# Altium project MSXIV_Rear_Power_Distribution.PrjPcb (part 1 of 4)
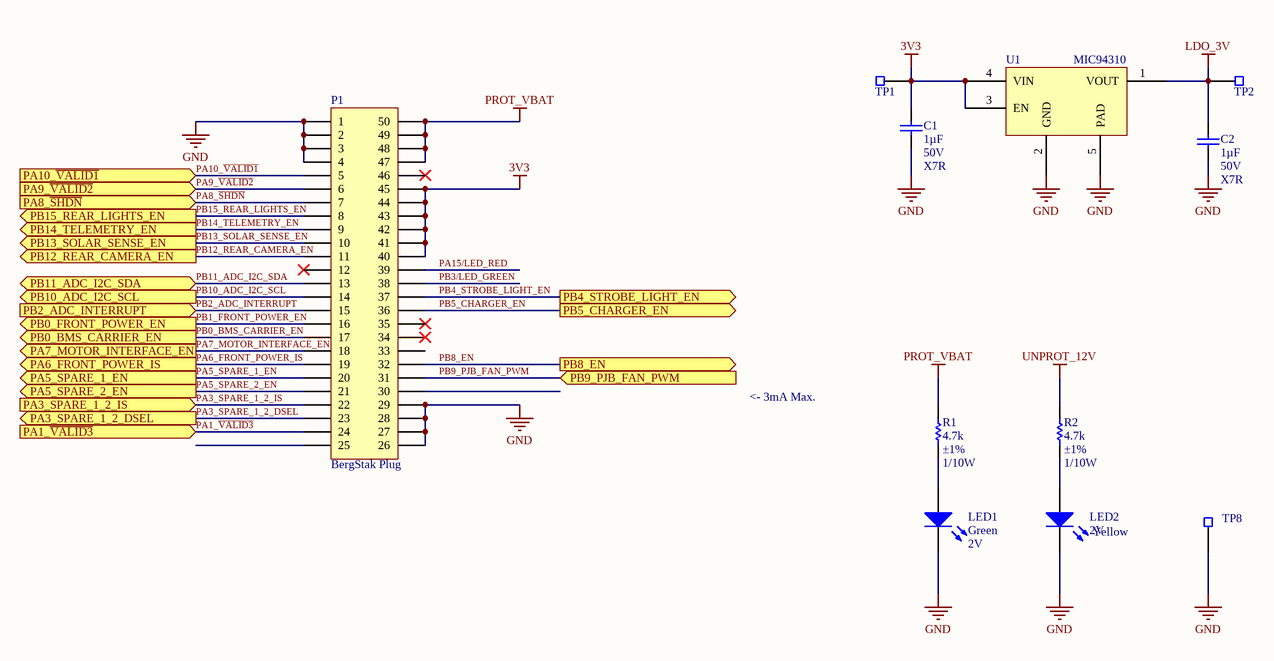
[diagram p0: Controller_Board_Interface.SchDoc]
19 sheets, 269 parts. Net scope: hierarchical (ports join the sheet entries above them; power ports are global).
Sheets:
  Controller_Board_Interface.SchDoc
  Power Distribution - Power Supply.SchDoc
  Power Distribution - DC-DC.SchDoc
    Temperature Sense = Power Distribution - Temperature Sense.SchDoc
  Power Distribution - Aux Battery.SchDoc
  Power Distribution - Power Path.SchDoc
    Designator = Power Distribution - Power Path 3 Parallel MOSFET.SchDoc
    Designator = Power Distribution - Power Path 2 Parallel MOSFET.SchDoc
    Designator = Power Distribution - Power Path 3 Parallel MOSFET.SchDoc
  Power Distribution - Hight Current Load Switch.SchDoc
  Power Distribution - Solar Sense and Strobe Light.SchDoc
    LLS? = Power Distribution - Low Current Load Driver.SchDoc
  Power Distribution - Motor Interface and Rear light (rear board).SchDoc
    LLS? = Power Distribution - Low Current Load Driver.SchDoc
  Power Distribution - Telemetry, BMS, Rear camera, and Charger (rear board).SchDoc
    LLS? = Power Distribution - Low Current Load Driver.SchDoc
    LLS? = Power Distribution - Low Current Load Driver.SchDoc
  Power Distribution - PJB.SchDoc
  Power Distribution - Output to front Power Board.SchDoc
  Power Distribution - External ADC.SchDoc
    ADC? = Power Distribution - ADC.SchDoc
    ADC? = Power Distribution - ADC.SchDoc
    ADC? = Power Distribution - ADC.SchDoc
  Power Distribution - IO Expander.SchDoc
  Power Distribution - Spare Load Switch.SchDoc
    LLS? = Power Distribution - Low Current Load Driver.SchDoc

## Sheet Controller_Board_Interface.SchDoc: Controller Board Interface
size B; Organization: Midnight Sun Solar Rayce Car Team; Address1: University of Waterloo; Address2: 200 University Ave W; Address3: Waterloo, ON, Canada; Address4: N2L 3E9; Website: www.uwmidsun.com; ProjectName: ProjectName

### Parts
C1  Capacitance: 1µF  Voltage: 50V  Temperature Coefficient: X7R  [CAP, 0603]  (hidden comment: CAP CER 1UF 50V 10% X7R 0603)
C2  Capacitance: 1µF  Voltage: 50V  Temperature Coefficient: X7R  [CAP, 0603]  (hidden comment: CAP CER 1UF 50V 10% X7R 0603)
LED1  Color: Green  Voltage - Forward (Vf) (Typ): 2V  [LED_0603]  (hidden comment: LED GREEN CLEAR 2V 0603)
LED2  Voltage - Forward (Vf) (Typ): 2V  [LED_0603]  (hidden comment: LED YELLOW CLEAR 2.1V 0603)
P1  Series: BergStak Plug  [CONN, Bergstak 50 Pos Plug]  (hidden comment: CONN 50POS Bergstak Plug 0.02")
R1  Resistance (Ohms): 4.7k  Tolerance: ±1%  Power (Watts): 1/10W  [RES, 0603]  (hidden comment: RES 4.7K OHM 1% 1/10W 0603)
R2  Resistance (Ohms): 4.7k  Tolerance: ±1%  Power (Watts): 1/10W  [RES, 0603]  (hidden comment: RES 4.7K OHM 1% 1/10W 0603)
TP1  Test Point 0603 SMD  [TEST POINT 0603 SMD]  (value not drawn)
TP2  Test Point 0603 SMD  [TEST POINT 0603 SMD]  (value not drawn)
TP8  Test Point 0603 SMD  [TEST POINT 0603 SMD]  (value not drawn)
U1  Manufacturer Part Number: MIC94310  [IC REG LDO 3V 0.2A 4-TDFN]  (hidden comment: IC REG LDO 3V 0.2A 4-TDFN)

### Ports
PA1_~{VALID3} (in), PA3_SPARE_1_2_DSEL (out), PA3_SPARE_1_2_IS (in), PA5_SPARE_1_EN (out), PA5_SPARE_2_EN (out), PA6_FRONT_POWER_IS (out), PA7_MOTOR_INTERFACE_EN (out), PA8_~{SHDN} (in), PA9_~{VALID2} (in), PA10_~{VALID1} (in), PB0_BMS_CARRIER_EN (out), PB0_FRONT_POWER_EN (out), PB2_ADC_INTERRUPT (in), PB4_STROBE_LIGHT_EN (out), PB5_CHARGER_EN (out), PB8_EN (out), PB9_PJB_FAN_PWM (in), PB10_ADC_I2C_SCL (out), PB11_ADC_I2C_SDA (bidir), PB12_REAR_CAMERA_EN (out), PB13_SOLAR_SENSE_EN (out), PB14_TELEMETRY_EN (out), PB15_REAR_LIGHTS_EN (out)

### Nets
3V3: C1.1 P1.40 P1.41 P1.42 P1.43 P1.44 P1.45 TP1.1 U1.3(EN) U1.4(VIN)
GND: C1.2 C2.2 LED1.2(K) LED2.2(K) P1.1 P1.2 P1.3 P1.4 P1.26 P1.27 P1.28 P1.29 TP8.1 U1.2(GND) U1.5(PAD)  [project net AUX_BAT_IN]
LDO_3V: C2.1 TP2.1 U1.1(VOUT)
PROT_VBAT: P1.47 P1.48 P1.49 P1.50 R1.1
UNPROT_12V: R2.1
PA1_~{VALID3}: P1.24 ; port PA1_~{VALID3}
PA3_SPARE_1_2_DSEL: P1.23 ; port PA3_SPARE_1_2_DSEL
PA3_SPARE_1_2_IS: P1.22 ; port PA3_SPARE_1_2_IS
PA5_SPARE_1_EN: P1.20 ; port PA5_SPARE_1_EN
PA5_SPARE_2_EN: P1.21 ; port PA5_SPARE_2_EN
PA6_FRONT_POWER_IS: P1.19 ; port PA6_FRONT_POWER_IS
PA7_MOTOR_INTERFACE_EN: P1.18 ; port PA7_MOTOR_INTERFACE_EN
PA8_~{SHDN}: P1.7 ; port PA8_~{SHDN}
PA9_~{VALID2}: P1.6 ; port PA9_~{VALID2}
PA10_~{VALID1}: P1.5 ; port PA10_~{VALID1}
PA15/LED_RED: P1.39
PB0_BMS_CARRIER_EN: P1.17 ; port PB0_BMS_CARRIER_EN
PB1_FRONT_POWER_EN: P1.16 ; port PB0_FRONT_POWER_EN
PB2_ADC_INTERRUPT: P1.15 ; port PB2_ADC_INTERRUPT
PB3/LED_GREEN: P1.38
PB4_STROBE_LIGHT_EN: P1.37 ; port PB4_STROBE_LIGHT_EN
PB5_CHARGER_EN: P1.36 ; port PB5_CHARGER_EN
PB8_EN: P1.32 ; port PB8_EN
PB9_PJB_FAN_PWM: P1.31 ; port PB9_PJB_FAN_PWM
PB10_ADC_I2C_SCL: P1.14 ; port PB10_ADC_I2C_SCL
PB11_ADC_I2C_SDA: P1.13 ; port PB11_ADC_I2C_SDA
PB12_REAR_CAMERA_EN: P1.11 ; port PB12_REAR_CAMERA_EN
PB13_SOLAR_SENSE_EN: P1.10 ; port PB13_SOLAR_SENSE_EN
PB14_TELEMETRY_EN: P1.9 ; port PB14_TELEMETRY_EN
PB15_REAR_LIGHTS_EN: P1.8 ; port PB15_REAR_LIGHTS_EN
NetLED1_1: LED1.1(A) R1.2
NetLED2_1: LED2.1(A) R2.2

Not connected (* = marked no-connect by the designer): P1 12* 25 30 33 34* 35* 46*

### Notes on the sheet
- <- 3mA Max.
- (near LED2) Yellow
- PROJECT
- DOCUMENT
- DRAWN BY
- LAST MODIFIED
- PART NUMBER
- REVISION
- SHEET
- VARIANT
- OF
- Engineering 5 - 1002
  University of Waterloo
  (519) 888-4567 x32978
  hardware@uwmidsun.com

### Library data of the parts
C1 C2 = CAP CER 1UF 50V 10% X7R 0603: 1µF ±10% 50V Ceramic Capacitor X7R 0603 (1608 Metric); Manufacturer 1: Taiyo Yuden; Manufacturer Part Number 1: UMK107AB7105KA-T; Supplier 1: Digi-Key; Supplier Part Number 1: 587-3247-1-ND; Packaging: Cut Tape (CT); Part Status: Active; Operating Temperature: -55°C ~ 125°C; Ratings: -; Mounting Type: Surface Mount, MLCC; Package / Case: 0603 (1608 Metric); Size / Dimension: 0.063" L x 0.031" W (1.60mm x 0.80mm); Height - Seated (Max): -; Thickness (Max): 0.037" (0.95mm); Lead Spacing: -; Lead Style: -; ComponentLink1URL: http://www.yuden.co.jp/productdata/catalog/en/mlcc_all_e.pdf; ComponentLink1Description: http://www.yuden.co.jp/productdata/catalog/en/mlcc_all_e.pdf; Tolerance: ±10%
LED1 = LED GREEN CLEAR 2V 0603: Green 572nm LED Indication - Discrete 2V 0603 (1608 Metric); Manufacturer: Wurth Electronics Inc.; Manufacturer Part Number: 150060VS75000; Lens Color: Colorless; Millicandela Rating: 40mcd; Lens Style/Size: Rectangle with Flat Top, 1.10mm x 0.70mm; Current - Test: 20mA; Viewing Angle: 140°; Wavelength - Dominant: 570nm; Supplier 1: Digi-Key; Supplier Part Number 1: 732-4980-1-ND; Packaging: Cut Tape (CT); Part Status: Active; Lens Transparency: Clear; Mounting Type: Surface Mount; Wavelength - Peak: 572nm; Package / Case: 0603 (1608 Metric); Supplier Device Package: 0603; Size / Dimension: 1.60mm L x 0.80mm W; Height (Max): 0.80mm; ComponentLink1URL: http://katalog.we-online.de/led/datasheet/150060VS75000.pdf; ComponentLink1Description: http://katalog.we-online.de/led/datasheet/150060VS75000.pdf; Category: Optoelectronics; Features: -; Pricing 1: 1=0.21, 100=0.1617, 500=0.13964 (CAD); RoHS: RoHS Compliant; Stock 1: 9408
LED2 = LED YELLOW CLEAR 2.1V 0603: Yellow 590nm LED Indication - Discrete 2V 0603 (1608 Metric); Manufacturer: Wurth Electronics Inc.; Manufacturer Part Number: 150060YS75000; Lens Color: Colorless; Millicandela Rating: 120mcd; Lens Style/Size: Rectangle with Flat Top, 1.10mm x 0.70mm; Current - Test: 20mA; Viewing Angle: 140°; Wavelength - Peak: 595nm; Supplier 1: Digi-Key; Supplier Part Number 1: 732-4981-1-ND; RoHS: RoHS Compliant; Category: Optoelectronics; Stock 1: 10523; Pricing 1: 1=0.21, 100=0.1617, 500=0.13964 (CAD); Packaging: Cut Tape (CT); Part Status: Active; Color: Yellow; Lens Transparency: Clear; Mounting Type: Surface Mount; Wavelength - Dominant: 590nm; Features: -; Package / Case: 0603 (1608 Metric); Size / Dimension: 1.60mm L x 0.80mm W; Height (Max): 0.80mm; ComponentLink1URL: http://katalog.we-online.de/led/datasheet/150060YS75000.pdf; ComponentLink1Description: http://katalog.we-online.de/led/datasheet/150060YS75000.pdf; Supplier Device Package: 0603
P1 = CONN 50POS Bergstak Plug 0.02": 50 Position Connector Plug, Outer Shroud Contacts Surface Mount Gold; Manufacturer 1: Amphenol FCI; Manufacturer Part Number 1: 10132797-055100LF; Number of Positions: 50; Mated Stacking Heights: 5mm; Pitch: 0.020" (0.50mm); Supplier 1: Digi-Key; Supplier Part Number 1: 609-5226-1-ND; Packaging: Cut Tape (CT); Part Status: Active; Connector Type: Plug, Outer Shroud Contacts; Number of Rows: 2; Mounting Type: Surface Mount; Contact Finish: Gold; Contact Finish Thickness: 1µin (0.025µm); Height Above Board: 0.169" (4.30mm); ComponentLink1URL: http://portal.fciconnect.com/Comergent//fci/drawing/10132797.pdf; ComponentLink1Description: http://portal.fciconnect.com/Comergent//fci/drawing/10132797.pdf
R1 R2 = RES 4.7K OHM 1% 1/10W 0603: 4.7k Ohm ±1% 0.1W, 1/10W Chip Resistor 0603 (1608 Metric) Moisture Resistant Thick Film; Manufacturer 1: Yageo; Manufacturer Part Number 1: RC0603FR-074K7L; Description 1: RES SMD 4.7K OHM 1% 1/10W 0603; Temperature Coefficient: ±100ppm/°C; Supplier 1: Digi-Key; Supplier Part Number 1: 311-4.70KHRCT-ND; RoHS: RoHS Compliant; Category: Resistors; Stock 1: 3487566; Pricing 1: 1=0.16, 10=0.022, 100=0.0089, 1000=0.00402, 2500=0.00349 (CAD); Packaging: Cut Tape (CT); Part Status: Active; Composition: Thick Film; Features: Moisture Resistant; Operating Temperature: -55°C ~ 155°C; Package / Case: 0603 (1608 Metric); Supplier Device Package: 0603; Size / Dimension: 0.063" L x 0.031" W (1.60mm x 0.80mm); Height - Seated (Max): 0.022" (0.55mm); Failure Rate: -; ComponentLink1URL: http://www.yageo.com/documents/recent/PYu-RC_Group_51_RoHS_L_7.pdf; ComponentLink1Description: http://www.yageo.com/documents/recent/PYu-RC_Group_51_RoHS_L_7.pdf
TP1 TP2 TP8 = Test Point 0603 SMD: Manufacturer 1: TE Connectivity; Manufacturer Part Number 1: 1625854-3; Description 1: Thick Film Resistors - SMD 2000; Resistance: 0mR; Supplier 1: Digi-Key; Supplier Part Number 1: A106145CT-ND; Stock 1: 212628; Pricing 1: 1=0.22, 10=0.211, 25=0.18, 50=0.1574, 100=0.1462, 250=0.12932, 500=0.12368, 1000=0.1012 (USD); Mount: Surface Mount; Case/Package: 0603; Colour: Natural; Case Code (Imperial): 0603; Case Code (Metric): 1608; Min Operating Temperature: -55°C; Max Operating Temperature: 125°C; Packaging: Tape and Reel; Termination: SMD/SMT; Package Quantity: 2000; Military Standard: Not; Length: 1.6mm; Height: 1.15mm; Width: 0.8mm; Depth: 0.8mm; Radiation Hardening: No; ComponentLink1URL: https://datasheet.ciiva.com/30100/1773266-a-30100967.pdf; ComponentLink1Description: https://datasheet.ciiva.com/30100/1773266-a-30100967.pdf; ComponentLink2URL: https://datasheet.ciiva.com/8914/eng-ds-1773266-a-8914634.pdf; ComponentLink2Description: https://datasheet.ciiva.com/8914/eng-ds-1773266-a-8914634.pdf; ComponentLink3URL: https://datasheet.ciiva.com/6439/eng-ds-1773266-a-6439163.pdf; ComponentLink3Description: https://datasheet.ciiva.com/6439/eng-ds-1773266-a-6439163.pdf; ComponentLink4URL: https://datasheet.ciiva.com/6439/eng-ds-1773266-a-6439164.pdf; ComponentLink4Description: https://datasheet.ciiva.com/6439/eng-ds-1773266-a-6439164.pdf; ComponentLink5URL: https://datasheet.ciiva.com/6439/eng-ds-1773266-a-6439165.pdf; ComponentLink5Description: https://datasheet.ciiva.com/6439/eng-ds-1773266-a-6439165.pdf
U1 = IC REG LDO 3V 0.2A 4-TDFN: Manufacturer: Microchip Technology; Regulator Topology: Positive Fixed; Current - Output: 200mA; Voltage - Dropout (Typical): 0.04V @ 200mA; Voltage - Input: Up to 3.6V; Current - Limit (Min): 250mA; Supplier 1: Digi-Key; RoHS: RoHS Compliant; Category: Integrated Circuits (ICs); Stock 1: 4802; Pricing 1: 1=0.45, 25=0.3708, 100=0.3386 (CAD); Packaging: Cut Tape (CT); Part Status: Active; Voltage - Output: 3V; Operating Temperature: -40°C ~ 125°C; Mounting Type: Surface Mount; Package / Case: 4-UFDFN Exposed Pad; Supplier Device Package: 4-TDFN (1.2x1.6); ComponentLink1URL: http://www.microchip.com/mymicrochip/filehandler.aspx?ddocname=en580409; ComponentLink1Description: http://www.microchip.com/mymicrochip/filehandler.aspx?ddocname=en580409; Supplier Part Number 1: 576-4761-1-ND

## Sheet Power Distribution - Power Supply.SchDoc: Title
size B; Organization: Midnight Sun Solar Rayce Car Team; Address1: University of Waterloo; Address2: 200 University Ave W; Address3: Waterloo, ON, Canada; Address4: N2L 3E9; Website: www.uwmidsun.com; ProjectName: ProjectName
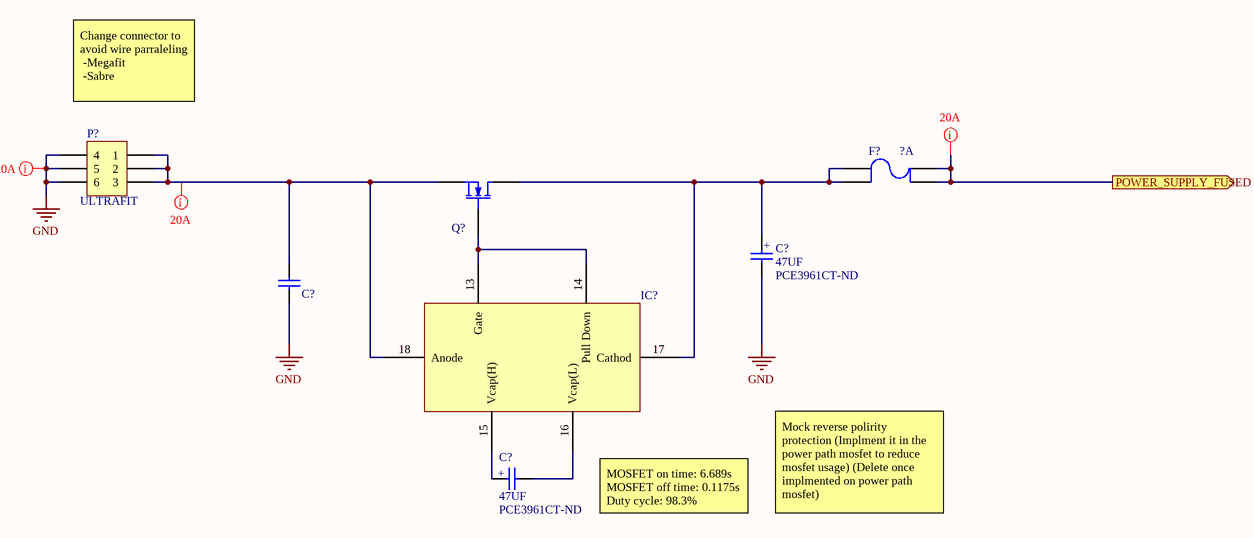
[diagram p1: Power Distribution - Power Supply.SchDoc]

### Parts
(Parts that share a designator on the sheet are numbered #1, #2 ... from top to bottom, then left to right.)
C?#1  47UF  Supplier Part Number 1: PCE3961CT-ND  [CAP ALUM 6.3MM RADIAL SMD]
C?#2  CAP CER 100PF 50V C0G/NP0 0603  [CAP, 0603]  (value not drawn)
C?#3  47UF  Supplier Part Number 1: PCE3961CT-ND  [CAP ALUM 6.3MM RADIAL SMD]
F?  ?A  [FUSE ATO/ATC FUSE HOLDER]
IC?  IC SMART DIODE CTLR 8VSSOP  (value not drawn)
P?#1  Series: ULTRAFIT  [CONN, 6POS ULTRA-FIT]  (hidden comment: CONN 6POS ULTRA-FIT 0.138")
Q?#1  MOSFET N-CH 60V 4A 3.3W SOT-223  [N-CH MOSFET SOT-23]  (value not drawn)

### Ports
POWER_SUPPLY_FUSED (out)

### Nets
GND: C?#1.2 C?#2.2 P?#1.4 P?#1.5 P?#1.6  [project net AUX_BAT_IN]
NetC?#1_1: C?#1.1 F?.1 F?.3 IC?.17(Cathod) Q?#1.3(D)
NetC?#2_1: C?#2.1 IC?.18(Anode) P?#1.1 P?#1.2 P?#1.3 Q?#1.2(S)
NetC?#3_1: C?#3.1 IC?.15(Vcap(H))
NetC?#3_2: C?#3.2 IC?.16(Vcap(L))
NetF?_2: F?.2 F?.4 ; port POWER_SUPPLY_FUSED
NetIC?_13: IC?.13(Gate) IC?.14(Pull_Down) Q?#1.1(G)

### Layout directives
net class HighCurrent; rule Power Plane Connect Style [Style - Direct Connect]; rule Polygon Connect Style [Style - Direct Connect]: AUX_BAT_IN, NetC?#2_1, NetF?_2

### Notes on the sheet
- Change connector to avoid wire parraleling
  -Megafit
  -Sabre
- (near IC?) MOSFET on time: 6.689s
  MOSFET off time: 0.1175s
  Duty cycle: 98.3%
- Mock reverse polirity protection (Implment it in the power path mosfet to reduce mosfet usage) (Delete once implmented on power path mosfet)
- PROJECT
- DOCUMENT
- DRAWN BY
- LAST MODIFIED
- PART NUMBER
- REVISION
- SHEET
- VARIANT
- OF
- Engineering 5 - 1002
  University of Waterloo
  (519) 888-4567 x32978
  hardware@uwmidsun.com
- (in symbol CAP ALUM 47UF 20% 35V SMD) +

### Library data of the parts
C?#1 C?#3 = CAP ALUM 47UF 20% 35V SMD: 47µF 35V Aluminum Electrolytic Capacitors Radial, Can - SMD 1000 Hrs @ 85°C; Manufacturer: Panasonic; Manufacturer Part Number: EEE-1VA470WP; Tolerance: 20%; Ripple Current: 70mA; Life (Hours): 1000Hour; Supplier 1: Digi-Key; Stock 1: 2820; Pricing 1: 1=0.38, 10=0.263, 100=0.1579, 500=0.11846 (USD); Mount: Surface Mount,PCB; Case/Package: Radial; Contact Plating: Tin; Min Operating Temperature: -40°C; Max Operating Temperature: 85°C; Capacitance: 47uF; Voltage Rating (DC): 35V; Voltage Rating: 35V; Packaging: Tape and Reel; Package Quantity: 1; Ripple Current (AC): 70mA; Termination: SMD/SMT; Diameter: 6.3mm; Length: 5.5mm; Height: 5.4mm; Height - Seated (Max): 0.213inch; Radiation Hardening: No; REACH SVHC: Unknown; Lead Free: Lead Free; ComponentLink1URL: https://datasheet.ciiva.com/2983/aba0000ce2-2983926.pdf; ComponentLink1Description: https://datasheet.ciiva.com/2983/aba0000ce2-2983926.pdf; ComponentLink2URL: https://datasheet.ciiva.com/2983/aba0000ce2-2983927.pdf; ComponentLink2Description: https://datasheet.ciiva.com/2983/aba0000ce2-2983927.pdf; ComponentLink3URL: https://datasheet.ciiva.com/14598/70255710-14598937.pdf; ComponentLink3Description: https://datasheet.ciiva.com/14598/70255710-14598937.pdf; ComponentLink4URL: https://datasheet.ciiva.com/15165/getdatasheetpartid-86239-15165868.pdf; ComponentLink4Description: https://datasheet.ciiva.com/15165/getdatasheetpartid-86239-15165868.pdf; ComponentLink5URL: https://datasheet.ciiva.com/16507/aba0000ce2-16507965.pdf; ComponentLink5Description: https://datasheet.ciiva.com/16507/aba0000ce2-16507965.pdf; ComponentLink6URL: https://datasheet.ciiva.com/30206/11aba0000ce2-30206253.pdf; ComponentLink6Description: https://datasheet.ciiva.com/30206/11aba0000ce2-30206253.pdf
C?#2 = CAP CER 100PF 50V C0G/NP0 0603: 100pF ±1% 50V Ceramic Capacitor C0G, NP0 0603 (1608 Metric); Manufacturer: Kyocera AVX; Manufacturer Part Number: 06035A101FAT2A; Supplier 1: Digi-Key; Stock 1: 176069; Pricing 1: 1=0.24, 10=0.161, 100=0.0814, 500=0.0557, 1000=0.0493 (USD); Mount: Surface Mount; Case/Package: 0603; Case Code (Imperial): 0603; Case Code (Metric): 1608; Min Operating Temperature: -55°C; Max Operating Temperature: 125°C; Capacitance: 100pF; Tolerance: 1%; Packaging: Tape and Reel; Voltage Rating: 50V; Package Quantity: 1; Voltage Rating (DC): 50V; Dielectric: C0G; Termination: SMD/SMT; Voltage: 50V; Length: 1.6mm; Height: 0.86mm; Width: 0.81mm; Thickness: 0.035inch; Depth: 0.81mm; Radiation Hardening: No; REACH SVHC: No SVHC; Lead Free: Lead Free; ComponentLink1URL: https://datasheet.ciiva.com/22682/1796416-22682854.pdf; ComponentLink1Description: https://datasheet.ciiva.com/22682/1796416-22682854.pdf; ComponentLink2URL: https://datasheet.ciiva.com/150/ccog-150746.pdf; ComponentLink2Description: https://datasheet.ciiva.com/150/ccog-150746.pdf; ComponentLink3URL: https://datasheet.ciiva.com/150/ccog-150747.pdf; ComponentLink3Description: https://datasheet.ciiva.com/150/ccog-150747.pdf; ComponentLink4URL: https://datasheet.ciiva.com/150/ccog-150748.pdf; ComponentLink4Description: https://datasheet.ciiva.com/150/ccog-150748.pdf; ComponentLink5URL: https://datasheet.ciiva.com/28585/1796416-28585980.pdf; ComponentLink5Description: https://datasheet.ciiva.com/28585/1796416-28585980.pdf; ComponentLink6URL: https://datasheet.ciiva.com/16300/ccog-16300413.pdf; ComponentLink6Description: https://datasheet.ciiva.com/16300/ccog-16300413.pdf; ComponentLink7URL: https://datasheet.ciiva.com/17492/ccog-17492189.pdf; ComponentLink7Description: https://datasheet.ciiva.com/17492/ccog-17492189.pdf; Supplier Part Number 1: 478-6202-1-ND
F? = FUSE ATO FUSE HOLDER: Fuse Block 30A 500V 1 Circuit Blade PCB; Manufacturer 1: Keystone Electronics; Manufacturer Part Number 1: 3557-2; Description 1: FUSE BLOCK BLADE 500V 30A PCB; For Use With/Related Products: ATC, ATO 257, MINI 897; Fuse Size: 0.43" L x 0.15" W x 0.64" H (10.92mm x 3.81mm x 16.25mm); Number of Circuits: 1; Supplier 1: Digi-Key; Supplier Part Number 1: 36-3557-2-ND; RoHS: RoHS Compliant; Category: Circuit Protection; Stock 1: 48838; Pricing 1: 1=1.66, 10=1.442, 50=1.3008, 100=1.2441, 250=1.13096, 500=1.01784, 1000=1.0126, 2500=0.84861, 5000=0.81519 (CAD); Part Status: Active; Fuseholder Type: Block; Fuse Type: Blade; Voltage: 500V; Current Rating: 30A; Mounting Type: PCB; Orientation: Vertical; Termination Style: PC Pin; Contact Material: Brass; Contact Finish: Tin Nickel; ComponentLink1URL: http://www.keyelco.com/product-pdf.cfm?p=296; ComponentLink1Description: http://www.keyelco.com/product-pdf.cfm?p=296
IC? = IC SMART DIODE CTLR 8VSSOP: OR Controller N+1 ORing Controller N-Channel N:1 8-VSSOP; Manufacturer: Texas Instruments; Internal Switch(s): No; Voltage - Supply: 42V (Max); Series: Automotive, AEC-Q100; Type: N+1 ORing Controller; Part Status: Active; FET Type: N-Channel; Ratio - Input:Output: N:1; Current - Output (Max): -; Operating Temperature: -40°C ~ 125°C; Applications: General Purpose; Package / Case: 8-TSSOP, 8-MSOP (0.118", 3.00mm Width); Supplier Device Package: 8-VSSOP; Mounting Type: Surface Mount; Supplier 1: Digi-Key; ComponentLink1Description: http://www.ti.com/lit/ds/symlink/lm74610-q1.pdf; ComponentLink1URL: http://www.ti.com/lit/ds/symlink/lm74610-q1.pdf; Supplier Part Number 1: 296-43067-1-ND
P?#1 = CONN 6POS ULTRA-FIT 0.138": 6 Positions Header Connector 0.138" (3.50mm) Through Hole Tin; Manufacturer 1: Molex, LLC; Manufacturer Part Number 1: 1722991106; Style: Board to Cable/Wire; Shrouding: Shrouded - 4 Wall; Number of Positions: 6; Number of Positions Loaded: All; Row Spacing - Mating: 0.181" (4.60mm); Contact Length - Post: 0.126" (3.20mm); Material Flammability Rating: UL94 V-0; Mated Stacking Heights: 26.99mm; Voltage: 400V; Supplier 1: Digi-Key; Supplier Part Number 1: WM11778-ND; Packaging: Tray; Part Status: Active; Connector Type: Header; Contact Type: Male Pin; Pitch - Mating: 0.138" (3.50mm); Number of Rows: 2; Mounting Type: Through Hole; Termination: Solder; Fastening Type: Latch Holder; Contact Length - Mating: -; Overall Contact Length: -; Insulation Height: 0.465" (11.80mm); Contact Shape: Square; Contact Finish - Mating: Tin; Contact Finish Thickness - Mating: 60µin (1.52µm); Contact Finish - Post: Tin; Contact Material: Copper Alloy; Insulation Material: Liquid Crystal Polymer (LCP); Operating Temperature: -40°C ~ 105°C; Ingress Protection: -; Insulation Color: Black; Current Rating: -; Contact Finish Thickness - Post: 60µin (1.52µm); ComponentLink1URL: http://www.molex.com/pdm_docs/sd/1722991106_sd.pdf; ComponentLink1Description: http://www.molex.com/pdm_docs/sd/1722991106_sd.pdf
Q?#1 = MOSFET N-CH 60V 4A 3.3W SOT-223: N-Channel 60V 4A (Tc) 3.3W (Tc) Surface Mount SOT-223; Manufacturer 1: STMicroelectronics; Manufacturer Part Number 1: STN3NF06L; Current - Continuous Drain (Id) @ 25°C: 4A (Tc); Drive Voltage (Max Rds On,  Min Rds On): 5V, 10V; Vgs(th) (Max) @ Id: 2.8V @ 250µA; Gate Charge (Qg) (Max) @ Vgs: 9nC @ 5V; Input Capacitance (Ciss) (Max) @ Vds: 340pF @ 25V; Vgs (Max): ±16V; Rds On (Max) @ Id, Vgs: 100 mOhm @ 1.5A, 10V; Supplier 1: Digi-Key; Supplier Part Number 1: 497-3177-1-ND; Packaging: Cut Tape (CT); Part Status: Active; FET Type: N-Channel; Technology: MOSFET (Metal Oxide); Drain to Source Voltage (Vdss): 60V; FET Feature: -; Power Dissipation (Max): 3.3W (Tc); Operating Temperature: -55°C ~ 150°C (TJ); Mounting Type: Surface Mount; Supplier Device Package: SOT-223; Package / Case: TO-261-4, TO-261AA; ComponentLink1URL: http://www.st.com/content/ccc/resource/technical/document/datasheet/b1/52/93/f0/a9/a9/40/d7/CD00002430.pdf/files/CD00002430.pdf/jcr:content/translations/en.CD00002430.pdf; ComponentLink1Description: http://www.st.com/content/ccc/resource/technical/document/datasheet/b1/52/93/f0/a9/a9/40/d7/CD00002430.pdf/files/CD00002430.pdf/jcr:content/translations/en.CD00002430.pdf

## Sheet Power Distribution - DC-DC.SchDoc: DC-DC Sense
size B; Organization: Midnight Sun Solar Rayce Car Team; Address1: University of Waterloo; Address2: 200 University Ave W; Address3: Waterloo, ON, Canada; Address4: N2L 3E9; Website: www.uwmidsun.com; ProjectName: ProjectName
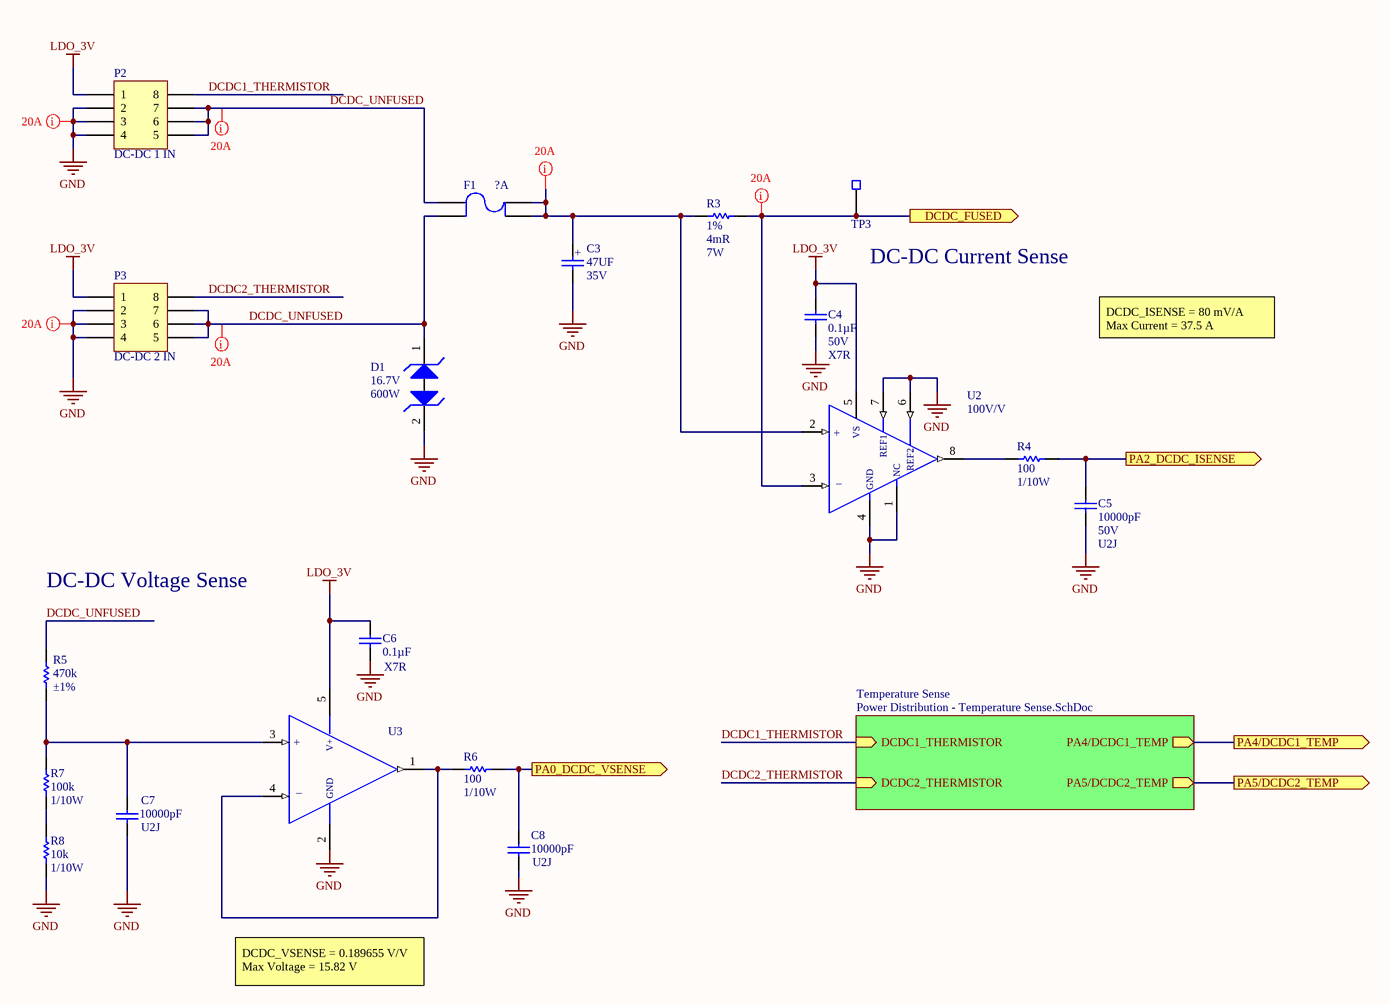
[diagram p2: Power Distribution - DC-DC.SchDoc]

### Parts
C3  47UF  Voltage Rating: 35V  [CAP ALUM 6.3MM RADIAL SMD]
C4  Capacitance: 0.1µF  Voltage: 50V  Temperature Coefficient: X7R  [CAP, 0603]  (hidden comment: CAP CER 0.1UF 50V 10% X7R 0603)
C5  Capacitance: 10000pF  Voltage: 50V  Temperature Coefficient: U2J  [CAP, 0603]  (hidden comment: CAP CER 10nF 50V 5% X7R 0603)
C6  Capacitance: 0.1µF  Temperature Coefficient: X7R  [CAP, 0603]  (hidden comment: CAP CER 0.1UF 50V 10% X7R 0603)
C7  Capacitance: 10000pF  Temperature Coefficient: U2J  [CAP, 0603]  (hidden comment: CAP CER 10nF 50V 5% X7R 0603)
C8  Capacitance: 10000pF  Temperature Coefficient: U2J  [CAP, 0603]  (hidden comment: CAP CER 10nF 50V 5% X7R 0603)
D1  Voltage - Breakdown (Min): 16.7V  Power - Peak Pulse: 600W  [DO-214AA Diode]  (hidden comment: DIODE TVS 15VWM 24.4VC DO-214AA (SMB))
F1  ?A  [FUSE ATO/ATC FUSE HOLDER]
P2  CONN 8POS ULTRA-FIT 0.138"  [CONN, 8POS ULTRA-FIT]  (value not drawn)
P3  CONN 8POS ULTRA-FIT 0.138"  [CONN, 8POS ULTRA-FIT]  (value not drawn)
R3  Tolerance: 1%  Resistance: 4mR  Max Power Dissipation: 7W  [RES 5931]  (hidden comment: RES 0.004 OHM 1% 7W 5931)
R4  Resistance: 100  Power: 1/10W  [RES, 0603]  (hidden comment: RES 100 OHM 1% 1/10W 0603)
R5  Resistance: 470k  Tolerance: ±1%  [RES, 0603]  (hidden comment: RES 470K OHM 1% 1/4W 0603)
R6  Resistance: 100  Power: 1/10W  [RES, 0603]  (hidden comment: RES 100 OHM 1% 1/10W 0603)
R7  Resistance: 100k  Power: 1/10W  [RES, 0603]  (hidden comment: RES 100K OHM 5% 1/8W 0603)
R8  Resistance: 10k  Power: 1/10W  [RES, 0603]  (hidden comment: RES 10K OHM 1% 1/10W 0603)
TP3  Test Point 0603 SMD  [TEST POINT 0603 SMD]  (value not drawn)
U2  100V/V  [IC CURRENT AMPLIFIER INA240 TSSOP-8]
U3  IC OP AMP GEN PURPOSE RR 10MHZ SOT-23-5  [IC OP AMP GP RR 10MHZ SOT-23-5]  (value not drawn)

### Sub-sheets
Temperature Sense = Power Distribution - Temperature Sense.SchDoc: DCDC1_THERMISTOR (in), DCDC2_THERMISTOR (in), PA4/DCDC1_TEMP (out), PA5/DCDC2_TEMP (out)

### Ports
DCDC_FUSED (out), PA0_DCDC_VSENSE (out), PA2_DCDC_ISENSE (out), PA4/DCDC1_TEMP (out), PA5/DCDC2_TEMP (out)

### Nets
GND: C3.2 C4.2 C5.2 C6.2 C7.2 C8.2 D1.2(Cathode2) P2.2 P2.3 P2.4 P3.2 P3.3 P3.4 R8.2 U2.1(NC) U2.4(GND) U2.6(REF2) U2.7(REF1) U3.2(VSS)  [project net AUX_BAT_IN]
LDO_3V: C4.1 C6.1 P2.1 P3.1 U2.5(VS) U3.5(VDD)
DCDC1_THERMISTOR: P2.8 ; sheet Temperature Sense/DCDC1_THERMISTOR
DCDC2_THERMISTOR: P3.8 ; sheet Temperature Sense/DCDC2_THERMISTOR
DCDC_UNFUSED: D1.1(Cathode1) F1.1 F1.3 P2.5 P2.6 P2.7 P3.5 P3.6 P3.7 R5.1
NetC3_1: C3.1 F1.2 F1.4 R3.1 U2.2(+IN)
NetC5_1: C5.1 R4.2 ; port PA2_DCDC_ISENSE
NetC7_1: C7.1 R5.2 R7.1 U3.3(+IN)
NetC8_1: C8.1 R6.2 ; port PA0_DCDC_VSENSE
NetC28_1: port PA4/DCDC1_TEMP, sheet Temperature Sense/PA4/DCDC1_TEMP
NetC?#6_1: port PA5/DCDC2_TEMP, sheet Temperature Sense/PA5/DCDC2_TEMP
NetR3_2: R3.2 TP3.1 U2.3(-IN) ; port DCDC_FUSED
NetR4_1: R4.1 U2.8(OUTPUT)
NetR6_1: R6.1 U3.1(OUTPUT) U3.4(-IN)
NetR7_2: R7.2 R8.1

### Layout directives
net class HighCurrent; rule Power Plane Connect Style [Style - Direct Connect]; rule Polygon Connect Style [Style - Direct Connect]: AUX_BAT_IN, DCDC_UNFUSED, NetC3_1, NetR3_2

### Notes on the sheet
- (near P2) DC-DC 1 IN
- DC-DC Current Sense
- (near P3) DC-DC 2 IN
- DCDC_ISENSE = 80 mV/A
  Max Current = 37.5 A
- DC-DC Voltage Sense
- DCDC_VSENSE = 0.189655 V/V
  Max Voltage = 15.82 V
- PROJECT
- DOCUMENT
- DRAWN BY
- LAST MODIFIED
- PART NUMBER
- REVISION
- SHEET
- VARIANT
- OF
- Engineering 5 - 1002
  University of Waterloo
  (519) 888-4567 x32978
  hardware@uwmidsun.com
- (in symbol CAP ALUM 47UF 20% 35V SMD) +
- (in symbol IC CURRENT AMPLIFIER INA240 8-TSSOP) +; _
- (in symbol IC OP AMP GEN PURPOSE RR 10MHZ SOT-23-5) V+; +; GND; _

### Library data of the parts
C3 = CAP ALUM 47UF 20% 35V SMD: as C?#1 on sheet Power Distribution - Power Supply; Supplier 1: Digi-Key; Stock 1: 2820; Pricing 1: 1=0.38, 10=0.263, 100=0.1579, 500=0.11846 (USD); Mount: Surface Mount,PCB; Case/Package: Radial; Contact Plating: Tin; Min Operating Temperature: -40°C; Max Operating Temperature: 85°C; Capacitance: 47uF; Voltage Rating (DC): 35V; Packaging: Tape and Reel; Package Quantity: 1; Ripple Current (AC): 70mA; Termination: SMD/SMT; Diameter: 6.3mm; Length: 5.5mm; Height: 5.4mm; Height - Seated (Max): 0.213inch; Radiation Hardening: No; REACH SVHC: Unknown; Lead Free: Lead Free; ComponentLink1URL: https://datasheet.ciiva.com/2983/aba0000ce2-2983926.pdf; ComponentLink1Description: https://datasheet.ciiva.com/2983/aba0000ce2-2983926.pdf; ComponentLink2URL: https://datasheet.ciiva.com/2983/aba0000ce2-2983927.pdf; ComponentLink2Description: https://datasheet.ciiva.com/2983/aba0000ce2-2983927.pdf; ComponentLink3URL: https://datasheet.ciiva.com/14598/70255710-14598937.pdf; ComponentLink3Description: https://datasheet.ciiva.com/14598/70255710-14598937.pdf; ComponentLink4URL: https://datasheet.ciiva.com/15165/getdatasheetpartid-86239-15165868.pdf; ComponentLink4Description: https://datasheet.ciiva.com/15165/getdatasheetpartid-86239-15165868.pdf; ComponentLink5URL: https://datasheet.ciiva.com/16507/aba0000ce2-16507965.pdf; ComponentLink5Description: https://datasheet.ciiva.com/16507/aba0000ce2-16507965.pdf; ComponentLink6URL: https://datasheet.ciiva.com/30206/11aba0000ce2-30206253.pdf; ComponentLink6Description: https://datasheet.ciiva.com/30206/11aba0000ce2-30206253.pdf; Supplier Part Number 1: PCE3961CT-ND
C4 C6 = CAP CER 0.1UF 50V 10% X7R 0603: 0.10µF ±10% 50V Ceramic Capacitor X7R 0603 (1608 Metric); Manufacturer 1: AVX Corporation; Manufacturer Part Number 1: 06035C104KAT2A; Supplier 1: Digi-Key; Supplier Part Number 1: 478-5052-1-ND; Packaging: Cut Tape (CT); Part Status: Active; Operating Temperature: -55°C ~ 125°C; Ratings: -; Mounting Type: Surface Mount, MLCC; Package / Case: 0603 (1608 Metric); Size / Dimension: 0.063" L x 0.032" W (1.60mm x 0.81mm); Height - Seated (Max): -; Thickness (Max): 0.035" (0.90mm); Lead Spacing: -; Lead Style: -; ComponentLink1URL: http://datasheets.avx.com/X7RDielectric.pdf; ComponentLink1Description: http://datasheets.avx.com/X7RDielectric.pdf; Tolerance: ±10%
  C6: Voltage: 50V
C5 C7 C8 = CAP CER 10nF 50V 5% X7R 0603: 10000pF ±5% 50V Ceramic Capacitor U2J 0603 (1608 Metric); Manufacturer 1: KEMET; Manufacturer Part Number 1: C0603C103J5JAC7867; Supplier 1: Digi-Key; Supplier Part Number 1: 399-13384-1-ND; Packaging: Cut Tape (CT); Part Status: Active; Operating Temperature: -55°C ~ 125°C; Ratings: -; Failure Rate: -; Mounting Type: Surface Mount, MLCC; Package / Case: 0603 (1608 Metric); Size / Dimension: 0.063" L x 0.032" W (1.60mm x 0.80mm); Height - Seated (Max): -; Thickness (Max): 0.034" (0.87mm); Lead Spacing: -; Lead Style: -; ComponentLink1URL: http://www.kemet.com/docfinder?Partnumber=C0603C103J5JAC7867; ComponentLink1Description: http://www.kemet.com/docfinder?Partnumber=C0603C103J5JAC7867; Tolerance: ±5%
  C7 C8: Voltage: 50V
D1 = DIODE TVS 15VWM 24.4VC DO-214AA (SMB): TVS DIODE 15VWM 24.4VC SMB; Manufacturer 1: Fairchild/ON Semiconductor; Manufacturer Part Number 1: SMBJ15CA; Type: Zener; Voltage - Reverse Standoff (Typ): 15V; Voltage - Clamping (Max) @ Ipp: 24.4V; Current - Peak Pulse (10/1000µs): 24.6A; Power Line Protection: No; Supplier 1: Digi-Key; Supplier Part Number 1: SMBJ15CAFSCT-ND; RoHS: RoHS Compliant; Description 1: TVS DIODE 15VWM 24.4VC SMB; Category: Circuit Protection; Stock 1: 24965; Pricing 1: 1=0.54, 10=0.444, 100=0.3027, 500=0.22704, 1000=0.17028 (CAD); Packaging: Cut Tape (CT); Part Status: Active; Applications: General Purpose; Capacitance @ Frequency: -; Operating Temperature: -55°C ~ 150°C (TJ); Mounting Type: Surface Mount; Package / Case: DO-214AA, SMB; Supplier Device Package: DO-214AA (SMB); ComponentLink1URL: https://www.fairchildsemi.com/datasheets/SM/SMBJ10CA.pdf; ComponentLink1Description: https://www.fairchildsemi.com/datasheets/SM/SMBJ10CA.pdf
F1 = FUSE ATO FUSE HOLDER: as F? on sheet Power Distribution - Power Supply; Supplier 1: Digi-Key; Supplier Part Number 1: 36-3557-2-ND; RoHS: RoHS Compliant; Category: Circuit Protection; Stock 1: 48838; Pricing 1: 1=1.66, 10=1.442, 50=1.3008, 100=1.2441, 250=1.13096, 500=1.01784, 1000=1.0126, 2500=0.84861, 5000=0.81519 (CAD); Part Status: Active; Fuseholder Type: Block; Fuse Type: Blade; Voltage: 500V; Current Rating: 30A; Mounting Type: PCB; Orientation: Vertical; Termination Style: PC Pin; Contact Material: Brass; Contact Finish: Tin Nickel; ComponentLink1URL: http://www.keyelco.com/product-pdf.cfm?p=296; ComponentLink1Description: http://www.keyelco.com/product-pdf.cfm?p=296
P2 P3 = CONN 8POS ULTRA-FIT 0.138": 8 Positions Header Connector 0.138" (3.50mm) Through Hole Tin; Manufacturer: Molex, LLC; Manufacturer Part Number: 1722991108; Style: Board to Cable/Wire; Shrouding: Shrouded - 4 Wall; Number of Positions: 8; Number of Positions Loaded: All; Row Spacing - Mating: 0.181" (4.60mm); Contact Length - Post: 0.126" (3.20mm); Material Flammability Rating: UL94 V-0; Voltage Rating: 400V; Mated Stacking Heights: 26.99mm; Supplier 1: Digi-Key; RoHS: RoHS Compliant; Category: Connectors, Interconnects; Stock 1: 60; Pricing 1: 1=2.12, 10=1.923, 50=1.7262, 100=1.6478, 250=1.49084, 500=1.37314, 1000=1.17697, 2500=1.0985, 5000=1.04358 (CAD); Packaging: Tray; Part Status: Active; Connector Type: Header; Contact Type: Male Pin; Pitch - Mating: 0.138" (3.50mm); Number of Rows: 2; Mounting Type: Through Hole; Termination: Solder; Fastening Type: Latch Holder; Contact Length - Mating: -; Overall Contact Length: -; Insulation Height: 0.465" (11.80mm); Contact Shape: Square; Contact Finish - Mating: Tin; Contact Finish Thickness - Mating: 60µin (1.52µm); Contact Finish - Post: Tin; Contact Material: Copper Alloy; Insulation Material: Liquid Crystal Polymer (LCP); Features: Board Guide, Solder Retention; Operating Temperature: -40°C ~ 105°C; Ingress Protection: -; Insulation Color: Black; Current Rating: -; Contact Finish Thickness - Post: 60µin (1.52µm); Applications: Automotive, General Purpose, Industrial, Lighting, Medical, Military, Telecommunications; ComponentLink1URL: http://www.molex.com/pdm_docs/sd/1722991108_sd.pdf; ComponentLink1Description: http://www.molex.com/pdm_docs/sd/1722991108_sd.pdf; Supplier Part Number 1: WM11779-ND
R3 = RES 0.004 OHM 1% 7W 5931: 4 mOhms ±1% 7W Chip Resistor Nonstandard Automotive AEC-Q200, Current Sense, Moisture Resistant Metal Element; Manufacturer 1: Yageo; Manufacturer Part Number 1: PU5931FKMP70R004L; Description 1: RES SMD 0.004 OHM 1% 7W 5931; Temperature Coefficient: 75ppm/°C; Supplier 1: Digi-Key; Supplier Part Number 1: YAG4096CT-ND; Stock 1: 1097; Pricing 1: 1=2.06, 10=1.823, 25=1.6904, 50=1.5912, 100=1.3922, 250=1.19336, 500=0.99446 (USD); Case/Package: 5931; Min Operating Temperature: -65°C; Max Operating Temperature: 170°C; Packaging: Cut Tape; Composition: Metal Element; Number of Terminations: 2; Length: 0.591inch; Height: 0.015inch; Width: 0.305inch; ComponentLink1URL: http://www.yageo.com/documents/recent/PYu-PU_51_RoHS_L_3.pdf; ComponentLink1Description: http://www.yageo.com/documents/recent/PYu-PU_51_RoHS_L_3.pdf
R4 R6 = RES 100 OHM 1% 1/10W 0603: 100 Ohm ±1% 0.1W, 1/10W Chip Resistor 0603 (1608 Metric) Moisture Resistant Thick Film; Manufacturer 1: Yageo; Manufacturer Part Number 1: RC0603FR-07100RL; Temperature Coefficient: ±100ppm/°C; Supplier 1: Digi-Key; Supplier Part Number 1: 311-100HRCT-ND; Packaging: Cut Tape (CT); Part Status: Active; Composition: Thick Film; Operating Temperature: -55°C ~ 155°C; Package / Case: 0603 (1608 Metric); Supplier Device Package: 0603; Size / Dimension: 0.063" L x 0.031" W (1.60mm x 0.80mm); Height - Seated (Max): 0.022" (0.55mm); Failure Rate: -; ComponentLink1URL: http://www.yageo.com/documents/recent/PYu-RC_Group_51_RoHS_L_7.pdf; ComponentLink1Description: http://www.yageo.com/documents/recent/PYu-RC_Group_51_RoHS_L_7.pdf; Tolerance: ±1%
R5 = RES 470K OHM 1% 1/4W 0603: RES SMD 470K OHM 1% 1/4W 0603; Manufacturer 1: Panasonic Electronic Components; Manufacturer Part Number 1: ERJ-PA3F4703V; Temperature Coefficient: ±100ppm/°C; Supplier 1: Digi-Key; Supplier Part Number 1: P470KBYCT-ND; Packaging: Cut Tape (CT); Part Status: Active; Composition: Thick Film; Operating Temperature: -55°C ~ 155°C; Package / Case: 0603 (1608 Metric); Supplier Device Package: 0603; Size / Dimension: 0.063" L x 0.031" W (1.60mm x 0.80mm); Height - Seated (Max): 0.022" (0.55mm); Failure Rate: -; ComponentLink1URL: https://industrial.panasonic.com/cdbs/www-data/pdf/RDO0000/AOA0000C291.pdf; ComponentLink1Description: https://industrial.panasonic.com/cdbs/www-data/pdf/RDO0000/AOA0000C291.pdf
R7 = RES 100K OHM 5% 1/8W 0603: RES SMD 100K OHM 5% 1/10W 0603; Manufacturer 1: Yageo; Manufacturer Part Number 1: RC0603JR-07100KL; Temperature Coefficient: ±100ppm/°C; Supplier 1: Digi-Key; Supplier Part Number 1: 311-100KGRCT-ND; Packaging: Cut Tape (CT); Part Status: Active; Composition: Thick Film; Operating Temperature: -55°C ~ 155°C; Package / Case: 0603 (1608 Metric); Supplier Device Package: 0603; Size / Dimension: 0.063" L x 0.031" W (1.60mm x 0.80mm); Height - Seated (Max): 0.022" (0.55mm); Failure Rate: -; ComponentLink1URL: http://www.yageo.com/documents/recent/PYu-RC_Group_51_RoHS_L_7.pdf; ComponentLink1Description: http://www.yageo.com/documents/recent/PYu-RC_Group_51_RoHS_L_7.pdf; Tolerance: ±5%
R8 = RES 10K OHM 1% 1/10W 0603: RES SMD 10K OHM 1% 1/10W 0603; Manufacturer 1: Yageo; Manufacturer Part Number 1: RC0603FR-0710KL; Temperature Coefficient: ±100ppm/°C; Supplier 1: Digi-Key; Supplier Part Number 1: 311-10.0KHRCT-ND; Packaging: Cut Tape (CT); Part Status: Active; Composition: Thick Film; Operating Temperature: -55°C ~ 155°C; Package / Case: 0603 (1608 Metric); Supplier Device Package: 0603; Size / Dimension: 0.063" L x 0.031" W (1.60mm x 0.80mm); Height - Seated (Max): 0.022" (0.55mm); Failure Rate: -; ComponentLink1URL: http://www.yageo.com/documents/recent/PYu-RC_Group_51_RoHS_L_7.pdf; ComponentLink1Description: http://www.yageo.com/documents/recent/PYu-RC_Group_51_RoHS_L_7.pdf; Tolerance: ±1%
TP3 = Test Point 0603 SMD: as TP1 on sheet Controller_Board_Interface; Supplier 1: Digi-Key; Supplier Part Number 1: A106145CT-ND; Stock 1: 212628; Pricing 1: 1=0.22, 10=0.211, 25=0.18, 50=0.1574, 100=0.1462, 250=0.12932, 500=0.12368, 1000=0.1012 (USD); Mount: Surface Mount; Case/Package: 0603; Colour: Natural; Case Code (Imperial): 0603; Case Code (Metric): 1608; Min Operating Temperature: -55°C; Max Operating Temperature: 125°C; Packaging: Tape and Reel; Termination: SMD/SMT; Package Quantity: 2000; Military Standard: Not; Length: 1.6mm; Height: 1.15mm; Width: 0.8mm; Depth: 0.8mm; Radiation Hardening: No; ComponentLink1URL: https://datasheet.ciiva.com/30100/1773266-a-30100967.pdf; ComponentLink1Description: https://datasheet.ciiva.com/30100/1773266-a-30100967.pdf; ComponentLink2URL: https://datasheet.ciiva.com/8914/eng-ds-1773266-a-8914634.pdf; ComponentLink2Description: https://datasheet.ciiva.com/8914/eng-ds-1773266-a-8914634.pdf; ComponentLink3URL: https://datasheet.ciiva.com/6439/eng-ds-1773266-a-6439163.pdf; ComponentLink3Description: https://datasheet.ciiva.com/6439/eng-ds-1773266-a-6439163.pdf; ComponentLink4URL: https://datasheet.ciiva.com/6439/eng-ds-1773266-a-6439164.pdf; ComponentLink4Description: https://datasheet.ciiva.com/6439/eng-ds-1773266-a-6439164.pdf; ComponentLink5URL: https://datasheet.ciiva.com/6439/eng-ds-1773266-a-6439165.pdf; ComponentLink5Description: https://datasheet.ciiva.com/6439/eng-ds-1773266-a-6439165.pdf
U2 = IC CURRENT AMPLIFIER INA240 8-TSSOP: Current Sense Amplifier 1 Circuit 8-TSSOP; Manufacturer 1: Texas Instruments; Manufacturer Part Number 1: INA240A3PWR; Description 1: IC AMP CURRENT SENSE 8-TSSOP; Slew Rate: 2 V/µs; Current - Supply: 1.8mA; Voltage - Supply, Single/Dual (±): 2.7 V ~ 5.5 V; Supplier 1: Digi-Key; Supplier Part Number 1: 296-45090-1-ND; RoHS: RoHS Compliant; Category: Integrated Circuits (ICs); Stock 1: 1286; Pricing 1: 1=3.79, 10=3.397, 100=2.7311, 500=2.24388, 1000=1.85921 (CAD); Packaging: Cut Tape (CT); Part Status: Active; Amplifier Type: Current Sense; Output Type: -; Operating Temperature: -40°C ~ 125°C; Mounting Type: Surface Mount; Package / Case: 8-TSSOP (0.173", 4.40mm Width); Supplier Device Package: 8-TSSOP; ComponentLink1URL: http://www.ti.com/lit/ds/symlink/ina240.pdf; ComponentLink1Description: http://www.ti.com/lit/ds/symlink/ina240.pdf
U3 = IC OP AMP GEN PURPOSE RR 10MHZ SOT-23-5: General Purpose Amplifier 1 Circuit Rail-to-Rail SOT-23-5; Manufacturer 1: Texas Instruments; Manufacturer Part Number 1: TLV316QDBVRQ1; Description 1: IC OP AMP GP RR 10MHZ 5-SOT-23; Number of Circuits: 1; Slew Rate: 6 V/µs; Current - Supply: 400µA; Current - Output / Channel: 50mA; Voltage - Supply, Single/Dual (±): 1.8 V ~ 5.5 V, ±0.9 V ~ 2.75 V; Supplier 1: Digi-Key; Supplier Part Number 1: 296-45323-1-ND; RoHS: RoHS Compliant; Category: Integrated Circuits (ICs); Stock 1: 1747; Pricing 1: 1=1.33, 10=1.185, 100=0.9234, 500=0.76276, 1000=0.60218 (CAD); Packaging: Cut Tape (CT); Part Status: Active; Amplifier Type: General Purpose; Output Type: Rail-to-Rail; -3db Bandwidth: -; Operating Temperature: -40°C ~ 125°C; Mounting Type: Surface Mount; Package / Case: SC-74A, SOT-753; Supplier Device Package: SOT-23-5; ComponentLink1URL: http://www.ti.com/lit/ds/symlink/tlv316-q1.pdf; ComponentLink1Description: http://www.ti.com/lit/ds/symlink/tlv316-q1.pdf

## Sheet Power Distribution - Temperature Sense.SchDoc: Temperature Sense
size B; Organization: Midnight Sun Solar Rayce Car Team; Address1: University of Waterloo; Address2: 200 University Ave W; Address3: Waterloo, ON, Canada; Address4: N2L 3E9; DocumentNumber: 5; SheetNumber: 5; SheetTotal: 10; Website: www.uwmidsun.com
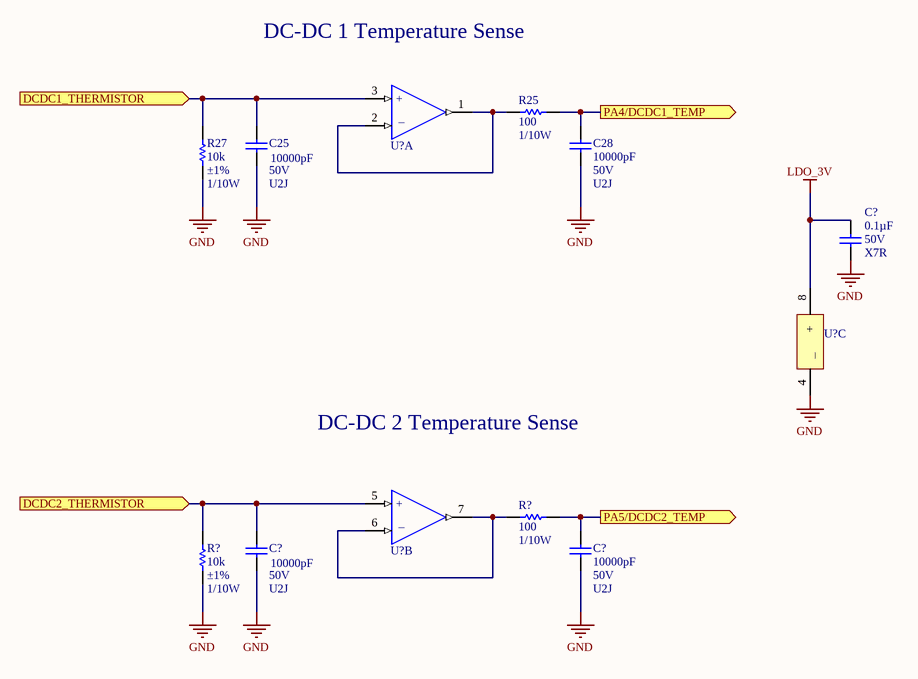
[diagram p3: Power Distribution - Temperature Sense.SchDoc]

### Parts
(Parts that share a designator on the sheet are numbered #1, #2 ... from top to bottom, then left to right.)
C25  Capacitance: 10000pF  Voltage: 50V  Temperature Coefficient: U2J  [CAP, 0603]  (hidden comment: CAP CER 10nF 50V 5% X7R 0603)
C28  Capacitance: 10000pF  Voltage: 50V  Temperature Coefficient: U2J  [CAP, 0603]  (hidden comment: CAP CER 10nF 50V 5% X7R 0603)
C?#4  Capacitance: 0.1µF  Voltage: 50V  Temperature Coefficient: X7R  [CAP, 0603]  (hidden comment: CAP CER 0.1UF 50V 10% X7R 0603)
C?#5  Capacitance: 10000pF  Voltage: 50V  Temperature Coefficient: U2J  [CAP, 0603]  (hidden comment: CAP CER 10nF 50V 5% X7R 0603)
C?#6  Capacitance: 10000pF  Voltage: 50V  Temperature Coefficient: U2J  [CAP, 0603]  (hidden comment: CAP CER 10nF 50V 5% X7R 0603)
R25  Resistance: 100  Power: 1/10W  [RES, 0603]  (hidden comment: RES 100 OHM 1% 1/10W 0603)
R27  Resistance: 10k  Tolerance: ±1%  Power: 1/10W  [RES, 0603]  (hidden comment: RES 10K OHM 1% 1/10W 0603)
R?#1  Resistance: 100  Power: 1/10W  [RES, 0603]  (hidden comment: RES 100 OHM 1% 1/10W 0603)
R?#2  Resistance: 10k  Tolerance: ±1%  Power: 1/10W  [RES, 0603]  (hidden comment: RES 10K OHM 1% 1/10W 0603)
U?#1  IC OP AMP DUAL GP RR 10MHZ 8-VSSOP  [IC DUAL OPAMP OPA2197 8-VSSOP]  (value not drawn)  (part A of 3)
U?#2  IC OP AMP DUAL GP RR 10MHZ 8-VSSOP  [IC DUAL OPAMP OPA2197 8-VSSOP]  (value not drawn)  (part C of 3)
U?#3  IC OP AMP DUAL GP RR 10MHZ 8-VSSOP  [IC DUAL OPAMP OPA2197 8-VSSOP]  (value not drawn)  (part B of 3)

### Ports
DCDC1_THERMISTOR (in), DCDC2_THERMISTOR (in), PA4/DCDC1_TEMP (out), PA5/DCDC2_TEMP (out)

### Nets
GND: C25.2 C28.2 C?#4.2 C?#5.2 C?#6.2 R27.2 R?#2.2 U?#2.4(_)  [project net AUX_BAT_IN]
LDO_3V: C?#4.1 U?#2.8(+)
DCDC1_THERMISTOR: C25.1 R27.1 U?#1.3(+IN_A) ; port DCDC1_THERMISTOR
DCDC2_THERMISTOR: C?#5.1 R?#2.1 U?#3.5(+IN_B) ; port DCDC2_THERMISTOR
NetC28_1: C28.1 R25.2 ; port PA4/DCDC1_TEMP
NetC?#6_1: C?#6.1 R?#1.2 ; port PA5/DCDC2_TEMP
NetR25_1: R25.1 U?#1.1(OUT_A) U?#1.2(-IN_A)
NetR?#1_1: R?#1.1 U?#3.6(-IN_B) U?#3.7(OUT_B)

### Notes on the sheet
- DC-DC 1 Temperature Sense
- DC-DC 2 Temperature Sense
- PROJECT
- DOCUMENT
- DRAWN BY
- LAST MODIFIED
- PART NUMBER
- REVISION
- SHEET
- VARIANT
- OF
- Engineering 5 - 1002
  University of Waterloo
  (519) 888-4567 x32978
  hardware@uwmidsun.com

### Library data of the parts
C25 C28 C?#5 C?#6 = CAP CER 10nF 50V 5% X7R 0603: as C5 on sheet Power Distribution - DC-DC; Supplier 1: Digi-Key; Supplier Part Number 1: 399-13384-1-ND; Packaging: Cut Tape (CT); Part Status: Active; Operating Temperature: -55°C ~ 125°C; Ratings: -; Failure Rate: -; Mounting Type: Surface Mount, MLCC; Package / Case: 0603 (1608 Metric); Size / Dimension: 0.063" L x 0.032" W (1.60mm x 0.80mm); Height - Seated (Max): -; Thickness (Max): 0.034" (0.87mm); Lead Spacing: -; Lead Style: -; ComponentLink1URL: http://www.kemet.com/docfinder?Partnumber=C0603C103J5JAC7867; ComponentLink1Description: http://www.kemet.com/docfinder?Partnumber=C0603C103J5JAC7867; Tolerance: ±5%
C?#4 = CAP CER 0.1UF 50V 10% X7R 0603: as C4 on sheet Power Distribution - DC-DC; Supplier 1: Digi-Key; Supplier Part Number 1: 478-5052-1-ND; Packaging: Cut Tape (CT); Part Status: Active; Operating Temperature: -55°C ~ 125°C; Ratings: -; Mounting Type: Surface Mount, MLCC; Package / Case: 0603 (1608 Metric); Size / Dimension: 0.063" L x 0.032" W (1.60mm x 0.81mm); Height - Seated (Max): -; Thickness (Max): 0.035" (0.90mm); Lead Spacing: -; Lead Style: -; ComponentLink1URL: http://datasheets.avx.com/X7RDielectric.pdf; ComponentLink1Description: http://datasheets.avx.com/X7RDielectric.pdf; Tolerance: ±10%
R25 R?#1 = RES 100 OHM 1% 1/10W 0603: as R4 on sheet Power Distribution - DC-DC; Supplier 1: Digi-Key; Supplier Part Number 1: 311-100HRCT-ND; Packaging: Cut Tape (CT); Part Status: Active; Composition: Thick Film; Operating Temperature: -55°C ~ 155°C; Package / Case: 0603 (1608 Metric); Supplier Device Package: 0603; Size / Dimension: 0.063" L x 0.031" W (1.60mm x 0.80mm); Height - Seated (Max): 0.022" (0.55mm); Failure Rate: -; ComponentLink1URL: http://www.yageo.com/documents/recent/PYu-RC_Group_51_RoHS_L_7.pdf; ComponentLink1Description: http://www.yageo.com/documents/recent/PYu-RC_Group_51_RoHS_L_7.pdf; Tolerance: ±1%
R27 R?#2 = RES 10K OHM 1% 1/10W 0603: as R8 on sheet Power Distribution - DC-DC; Supplier 1: Digi-Key; Supplier Part Number 1: 311-10.0KHRCT-ND; Packaging: Cut Tape (CT); Part Status: Active; Composition: Thick Film; Operating Temperature: -55°C ~ 155°C; Package / Case: 0603 (1608 Metric); Supplier Device Package: 0603; Size / Dimension: 0.063" L x 0.031" W (1.60mm x 0.80mm); Height - Seated (Max): 0.022" (0.55mm); Failure Rate: -; ComponentLink1URL: http://www.yageo.com/documents/recent/PYu-RC_Group_51_RoHS_L_7.pdf; ComponentLink1Description: http://www.yageo.com/documents/recent/PYu-RC_Group_51_RoHS_L_7.pdf
U?#1-U?#3 = IC OP AMP DUAL GP RR 10MHZ 8-VSSOP: General Purpose Amplifier 2 Circuit Rail-to-Rail 8-VSSOP; Manufacturer: Texas Instruments; Manufacturer Part Number: OPA2197IDGKR; Number of Circuits: 2; Slew Rate: 20V/µs; Input Bias Current: 5pA; Input Offset Voltage (Vos): 250uV; Operating Supply Current: 1mA; Output Current per Channel: 65mA; Supplier 1: Digi-Key; Stock 1: 2171; Pricing 1: 1=2.41, 10=2.162, 100=1.7376, 500=1.4276, 1000=1.1829 (USD); Mount: Surface Mount; Case/Package: VSSOP; Min Operating Temperature: -40°C; Max Operating Temperature: 125°C; Packaging: Tape and Reel; Gain Bandwidth Product: 10MHz; Number of Channels: 2; Lead Free: Lead Free; ComponentLink1URL: http://www.ti.com/lit/ds/symlink/opa2197.pdf; ComponentLink1Description: http://www.ti.com/lit/ds/symlink/opa2197.pdf; Supplier Part Number 1: 296-47349-1-ND